# Altium schematic sheet 2.ETH.SchDoc
size A3
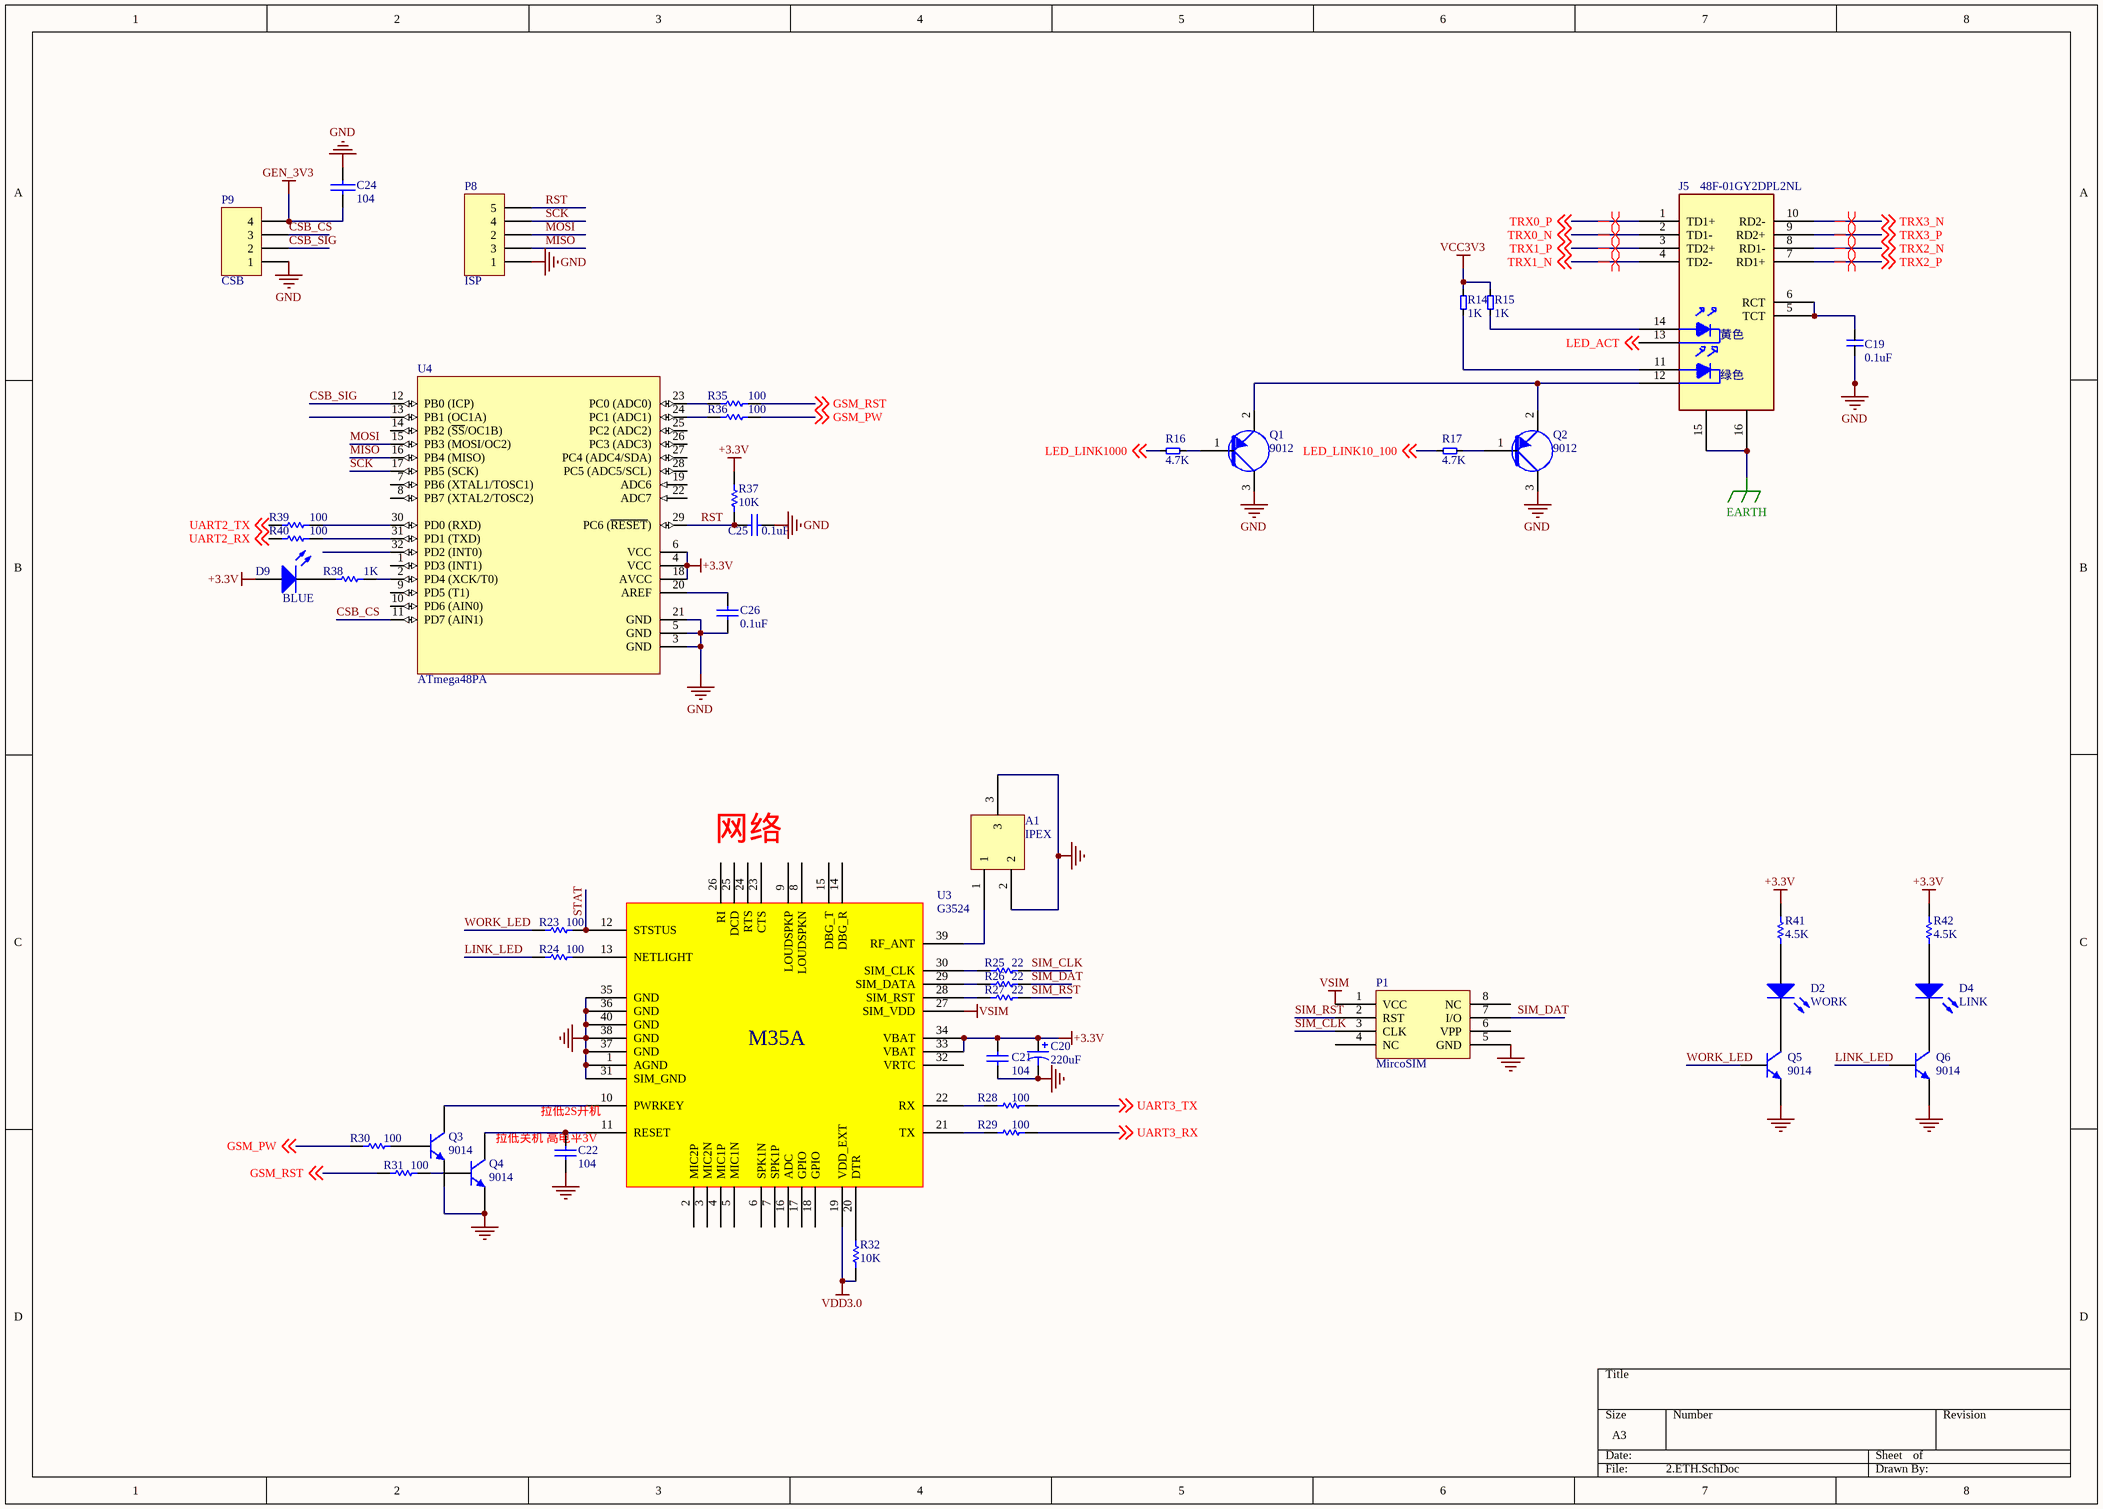
[diagram p0: 2.ETH.SchDoc]

## Parts
A1  IPEX  [IPEX]
C19  0.1uF  [0603C]
C20  value 220uF  [C7343]  (hidden comment: Cap Pol3)
C21  value 104  [0603]  (hidden comment: Cap)
C22  value 104  [0603]  (hidden comment: Cap)
C24  104  [0603]
C25  value 0.1uF  [0603]  (hidden comment: Cap)
C26  value 0.1uF  [0603]  (hidden comment: Cap)
D2  WORK  [0603-LED]
D4  LINK  [0603-LED]
D9  BLUE  [0603-LED]
J5  48F-01GY2DPL2NL  [RJ45C-48F-01GY2DPL2NL]
P1  MircoSIM  [Micro SIM]
P8  ISP  [HDR1X5]
P9  CSB  [HDR1X4]
Q1  9012  [SOT-23-PMOS]
Q2  9012  [SOT-23-PMOS]
Q3  value 9014  [SOT-23-NPN]  (hidden comment: NPN)
Q4  value 9014  [SOT-23-NPN]  (hidden comment: NPN)
Q5  value 9014  [SOT-23-NPN]  (hidden comment: NPN)
Q6  value 9014  [SOT-23-NPN]  (hidden comment: NPN)
R14  1K  [0603R]
R15  1K  [0603R]
R16  4.7K  [0603R]
R17  4.7K  [0603R]
R23  value 100  [0603]  (hidden comment: Res1)
R24  value 100  [0603]  (hidden comment: Res1)
R25  value 22  [0603]  (hidden comment: Res1)
R26  value 22  [0603]  (hidden comment: Res1)
R27  value 22  [0603]  (hidden comment: Res1)
R28  value 100  [0603]  (hidden comment: Res1)
R29  value 100  [0603]  (hidden comment: Res1)
R30  value 100  [0603]  (hidden comment: Res1)
R31  value 100  [0603]  (hidden comment: Res1)
R32  value 10K  [0603]  (hidden comment: Res1)
R35  value 100  [0603]  (hidden comment: Res1)
R36  value 100  [0603]  (hidden comment: Res1)
R37  value 10K  [0603]  (hidden comment: Res1)
R38  1K  [0603]
R39  value 100  [0603]  (hidden comment: Res1)
R40  value 100  [0603]  (hidden comment: Res1)
R41  value 4.5K  [0603]  (hidden comment: Res1)
R42  value 4.5K  [0603]  (hidden comment: Res1)
U3  G3524  [G3524]
U4  ATmega48PA  [32A_M]

## Nets
+3.3V: C20.1 C21.2 D9.1(A) R37.2 R41.1 R42.1 U3.33(VBAT) U3.34(VBAT) U4.4(VCC) U4.6(VCC) U4.18(AVCC)
EARTH: J5.15 J5.16
GEN_3V3: C24.2 P9.4
GND: A1.2 A1.3 C19.2 C20.2 C21.1 C22.2 C24.1 C25.2 C26.2 P1.5(GND) P8.1 P9.1 Q1.3 Q2.3 Q3.1(E) Q4.1(E) Q5.1(E) Q6.1(E) U3.1(AGND) U3.31(SIM_GND) U3.35(GND) U3.36(GND) U3.37(GND) U3.38(GND) U3.40(GND) U4.3(GND) U4.5(GND) U4.21(GND)
VCC3V3: R14.2 R15.2
VDD3.0: R32.2 U3.19(VDD_EXT)
VSIM: P1.1(VCC) U3.27(SIM_VDD)
CSB_CS: P9.3 U4.11(PD7_(AIN1))
CSB_SIG: P9.2 U4.12(PB0_(ICP))
GSM_PW: R30.2 R36.1 ; off-sheet GSM_PW
GSM_RST: R31.2 R35.1 ; off-sheet GSM_RST
LED_ACT: J5.13 ; off-sheet LED_ACT
LED_LINK10_100: R17.2 ; off-sheet LED_LINK10_100
LED_LINK1000: R16.2 ; off-sheet LED_LINK1000
LINK_LED: Q6.2(B) R24.2
MISO: P8.3 U4.16(PB4_(MISO))
MOSI: P8.2 U4.15(PB3_(MOSI/OC2))
RST: C25.1 P8.5 R37.1 U4.29(PC6_(~{RESET}))
SCK: P8.4 U4.17(PB5_(SCK))
SIM_CLK: P1.3(CLK) R25.1
SIM_DAT: P1.7(I/O) R26.1
SIM_RST: P1.2(RST) R27.1
STAT: R23.1 U3.12(STSTUS)
TRX0_N: J5.2(TD1-) ; off-sheet TRX0_N
TRX0_P: J5.1(TD1+) ; off-sheet TRX0_P
TRX1_N: J5.4(TD2-) ; off-sheet TRX1_N
TRX1_P: J5.3(TD2+) ; off-sheet TRX1_P
TRX2_N: J5.8(RD1-) ; off-sheet TRX2_N
TRX2_P: J5.7(RD1+) ; off-sheet TRX2_P
TRX3_N: J5.10(RD2-) ; off-sheet TRX3_N
TRX3_P: J5.9(RD2+) ; off-sheet TRX3_P
UART2_RX: R40.2 ; off-sheet UART2_RX
UART2_TX: R39.2 ; off-sheet UART2_TX
UART3_RX: R29.2 ; off-sheet UART3_RX
UART3_TX: R28.2 ; off-sheet UART3_TX
WORK_LED: Q5.2(B) R23.2
NetA1_1: A1.1 U3.39(RF_ANT)
NetC19_1: C19.1 J5.5(TCT) J5.6(RCT)
NetC22_1: C22.1 Q4.3(C) U3.11(RESET)
NetC26_1: C26.1 U4.20(AREF)
NetD2_1: D2.1(A) R41.2
NetD2_2: D2.2(K) Q5.3(C)
NetD4_1: D4.1(A) R42.2
NetD4_2: D4.2(K) Q6.3(C)
NetD9_2: D9.2(K) R38.2
NetJ5_11: J5.11 R14.1
NetJ5_12: J5.12 Q1.2 Q2.2
NetJ5_14: J5.14 R15.1
NetQ1_1: Q1.1 R16.1
NetQ2_1: Q2.1 R17.1
NetQ3_2: Q3.2(B) R30.1
NetQ3_3: Q3.3(C) U3.10(PWRKEY)
NetQ4_2: Q4.2(B) R31.1
NetR24_1: R24.1 U3.13(NETLIGHT)
NetR25_2: R25.2 U3.30(SIM_CLK)
NetR26_2: R26.2 U3.29(SIM_DATA)
NetR27_2: R27.2 U3.28(SIM_RST)
NetR28_1: R28.1 U3.22(RX)
NetR29_1: R29.1 U3.21(TX)
NetR32_1: R32.1 U3.20(DTR)
NetR35_2: R35.2 U4.23(PC0_(ADC0))
NetR36_2: R36.2 U4.24(PC1_(ADC1))
NetR38_1: R38.1 U4.2(PD4_(XCK/T0))
NetR39_1: R39.1 U4.30(PD0_(RXD))
NetR40_1: R40.1 U4.31(PD1_(TXD))

Not connected (* = marked no-connect by the designer): P1 4(NC) 6(VPP) 8(NC); U3 2(MIC2P) 3(MIC2N) 4(MIC1P) 5(MIC1N) 6(SPK1N) 7(SPK1P) 8(LOUDSPKN) 9(LOUDSPKP) 14(DBG_R) 15(DBG_T) 16(ADC) 17(GPIO) 18(GPIO) 23(CTS) 24(RTS) 25(DCD) 26(RI) 32(VRTC); U4 1(PD3_(INT1)) 7(PB6_(XTAL1/TOSC1)) 8(PB7_(XTAL2/TOSC2)) 9(PD5_(T1)) 10(PD6_(AIN0)) 13(PB1_(OC1A)) 14(PB2_(~{SS}/OC1B)) 19(ADC6) 22(ADC7) 25(PC2_(ADC2)) 26(PC3_(ADC3)) 27(PC4_(ADC4/SDA)) 28(PC5_(ADC5/SCL)) 32(PD2_(INT0))

## Layout directives
differential pair: TRX0_N, TRX0_P, TRX1_N, TRX1_P, TRX2_N, TRX2_P, TRX3_N, TRX3_P

## Notes on the sheet
- 网络
- (near C22) 拉低2S开机
- 拉低关机 高电平3V
- (in symbol 48F-01GY2DPL2NL) 黄色; 绿色
- (in symbol G3524) M35A

## Library data of the parts
C19 = 电容
C20 = Cap Pol3: Polarized Capacitor (Surface Mount); Published: 8-Jun-2000; LatestRevisionDate: 17-Jul-2002; LatestRevisionNote: Re-released for DXP Platform.; PackageReference: C0805; Publisher: Altium Limited
C21 C22 C25 C26 = Cap: Capacitor; Published: 8-Jun-2000; LatestRevisionDate: 17-Jul-2002; LatestRevisionNote: Re-released for DXP Platform.; PackageReference: RAD-0.3; Publisher: Altium Limited
C24 = CAP
D2 D4 = LED2: Typical RED, GREEN, YELLOW, AMBER GaAs LED; Value: GRN; Published: 8-Jun-2000; LatestRevisionDate: 17-Jul-2002; LatestRevisionNote: Re-released for DXP Platform.; PackageDocument: Feb-2002; PackageReference: 3.2X1.6X1.1; Publisher: Altium Limited
D9 = LED2: Typical RED, GREEN, YELLOW, AMBER GaAs LED
P8 = Header 5: Header, 5-Pin; LatestRevisionDate: 17-Jul-2002; LatestRevisionNote: Re-released for DXP Platform.; Publisher: Altium Limited
P9 = Header 4: Header, 4-Pin; LatestRevisionDate: 17-Jul-2002; LatestRevisionNote: Re-released for DXP Platform.; Publisher: Altium Limited
Q3-Q6 = 2N5551: NPN General Purpose Amplifier; Published: 8-Jun-2000; LatestRevisionDate: 17-Jan-2003; LatestRevisionNote: PCB Footprint 'BCY-W3/D4.7' replaced; DatasheetDocument: 1997; PackageDocument: Sep-1998; PackageReference: TO-92A; Publisher: Altium Limited; ComponentLink1Description: Manufacturer Link; ComponentLink1URL: http://www.fairchildsemi.com/; ComponentLink2Description: Datasheet; ComponentLink2URL: http://www.fairchildsemi.com/ds/2N%2F2N5551.pdf
R14-R17 = 电阻
R23-R32 R35-R42 = Res1: Resistor
  R23-R32 R35-R37 R39-R42: Published: 8-Jun-2000; LatestRevisionDate: 17-Jul-2002; LatestRevisionNote: Re-released for DXP Platform.; PackageReference: AXIAL-0.3; Publisher: Altium Limited
U4 = ATmega8-16AC: 8-Bit AVR Microcontroller with 8K Bytes of In-System Programmable Flash Memory; Published: 17-Sep-2003; LatestRevisionDate: 13-Apr-2006; LatestRevisionNote: IPC-7351 Footprint Added.; DatasheetVersion: 2486H-AVR-09/02; PackageVersion: revB, Oct-2001; PackageReference: 32A; Publisher: Altium Limited; PackageDescription: 32-Pin Thin Quad Flat Pack 0.8 mm Pitch; Code_JEDEC: MS-026-ABA; ComponentLink1Description: Manufacturer Link; ComponentLink1URL: http://www.atmel.com; ComponentLink2Description: Datasheet; ComponentLink2URL: http://www.atmel.com/dyn/resources/prod_documents/doc2486.pdf